# EAGLE design attinier85-motherboard-smd-mk-2.1 (EAGLE 7.5.0)
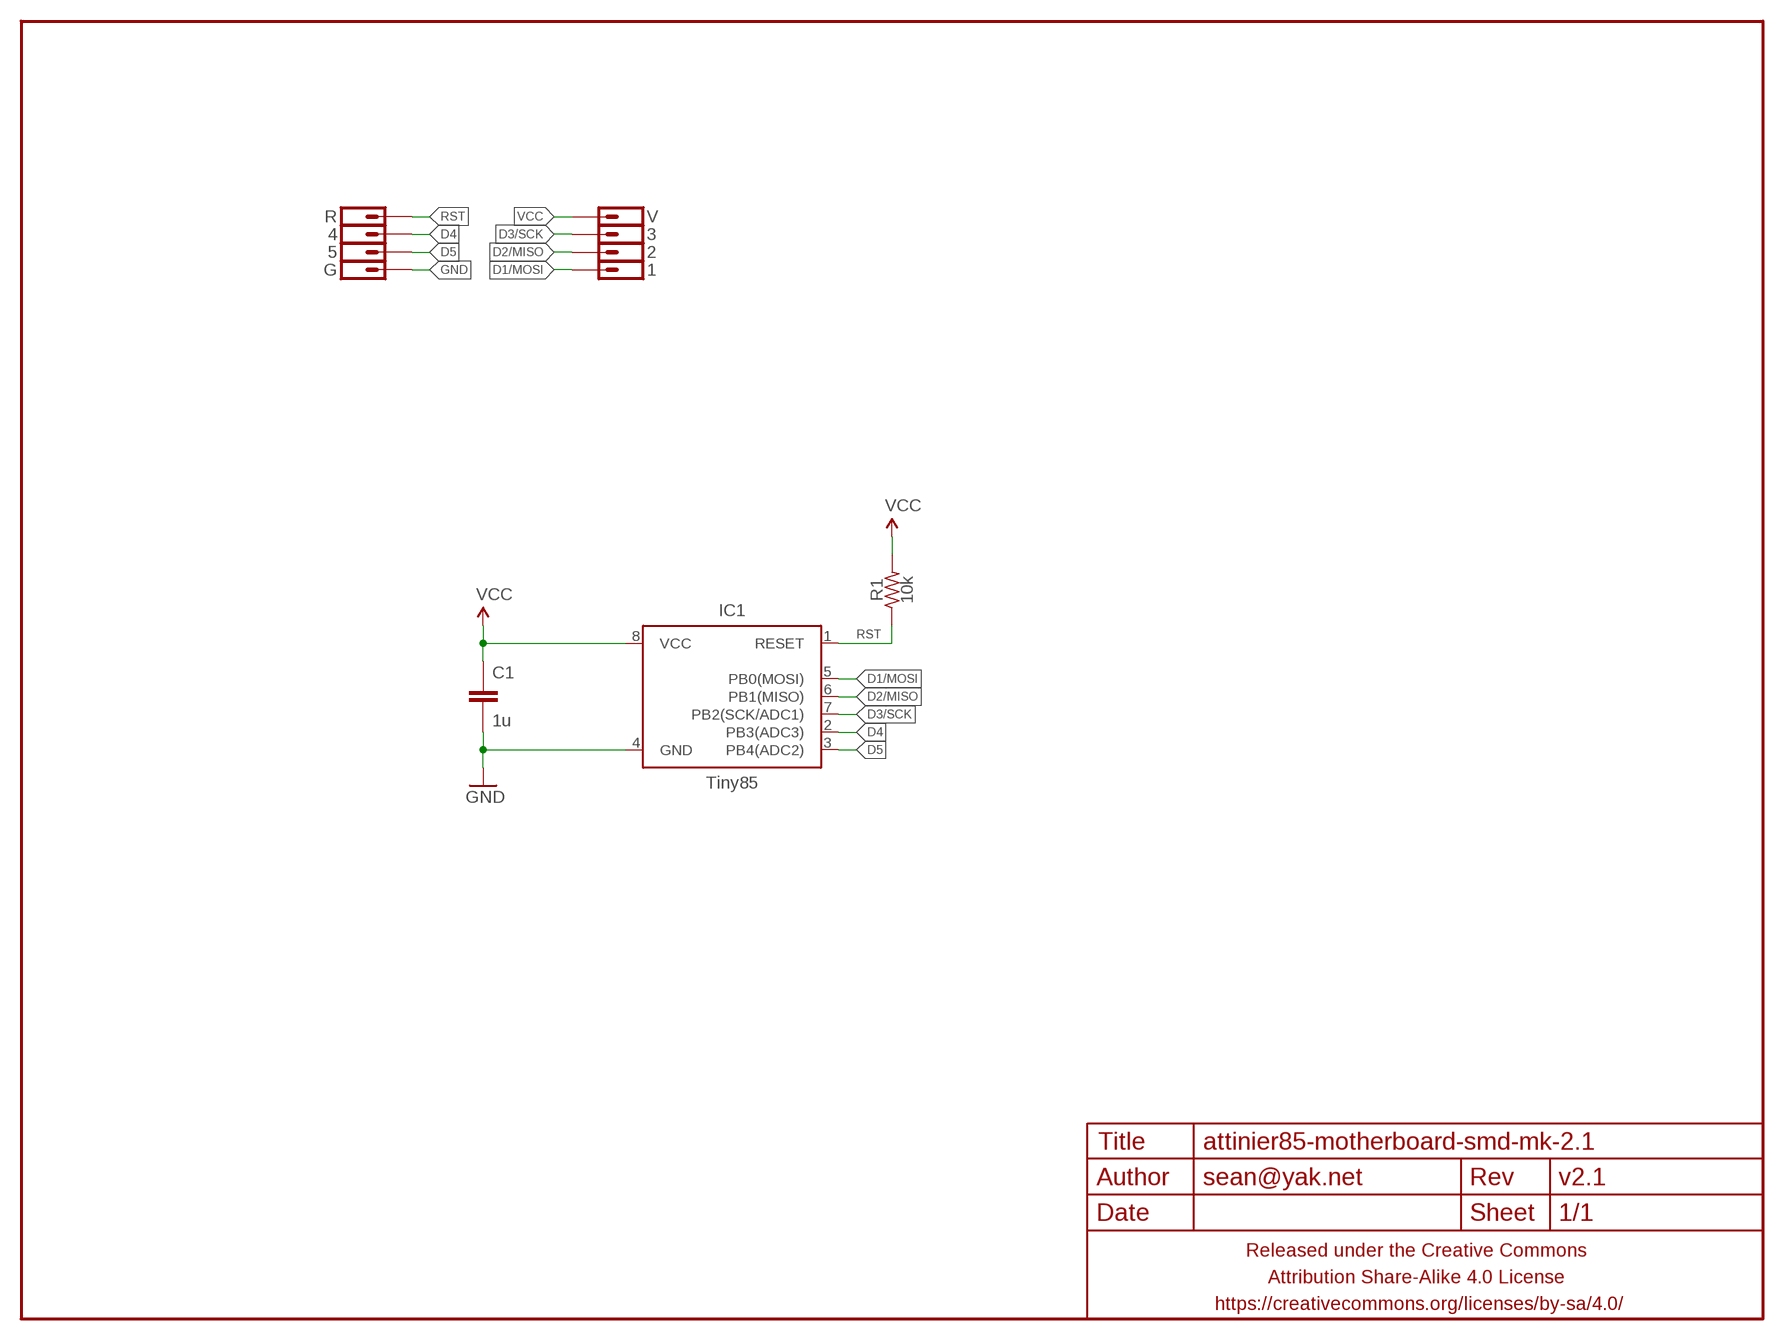
[diagram p0: schematic, sheet 1]

## Parts
1  M01PTH-0.9MM  [1X01-0.9MM]
2  M01PTH-0.9MM  [1X01-0.9MM]
3  M01PTH-0.9MM  [1X01-0.9MM]
4  M01PTH-0.9MM  [1X01-0.9MM]
5  M01PTH-0.9MM  [1X01-0.9MM]
C1  1u  CAPACITOR-CERAMICC0603-TIGHTER  [C0603-TIGHTER]
FRAME1  FRAME-LETTERNO_PACKAGE  [DUMMY]
G  M01PTH-0.9MM  [1X01-0.9MM]
IC1  Tiny85  ATTINY45TINY85-20-SOICW  [SO08-EIAJ]
R  M01PTH-0.9MM  [1X01-0.9MM]
R1  10k  RESISTORR0603-TIGHTER  [R0603-TIGHTER]
V  M01PTH-0.9MM  [1X01-0.9MM]

## Nets
D1/MOSI: 1.1 IC1.5(PB0(MOSI))
D2/MISO: 2.1 IC1.6(PB1(MISO))
D3/SCK: 3.1 IC1.7(PB2(SCK/ADC1))
D4: 4.1 IC1.2(PB3(ADC3))
D5: 5.1 IC1.3(PB4(ADC2))
GND: C1.2 G.1 IC1.4(GND)
RST: IC1.1(RESET) R1.1 R.1
VCC: C1.1 IC1.8(VCC) R1.2 V.1

## Library data of the parts
1-5 G R V = a_parts:M01: Header 1 Standard 1-pin 0.1" header. Use with straight break away headers (SKU : PRT-00116), right angle break away headers (PRT-00553), swiss pins (PRT-00743), machine pins (PRT-00117), and female headers (PRT-00115).
C1 = a_parts:CAPACITOR-CERAMIC: CAPACITOR, European symbol
FRAME1 = a_parts:FRAME-LETTER: Schematic Frame Standard 8.5x11 US Letter frame; DESIGNER: sean@yak.net; VERSION: v2.1
IC1 = a_parts:ATTINY45: Atmel 8-pin 2/4/8kB flash uC; PROD_ID: IC-09092; VALUE: Tiny85-20-SMT
R1 = a_parts:RESISTOR: RESISTOR, American symbol

## Board
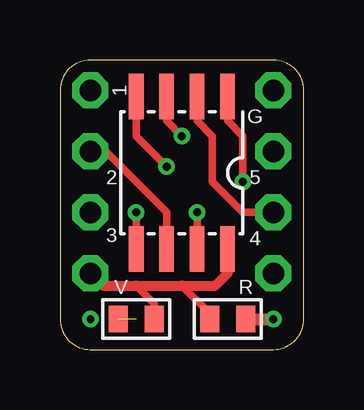
[diagram p1: board, top side]
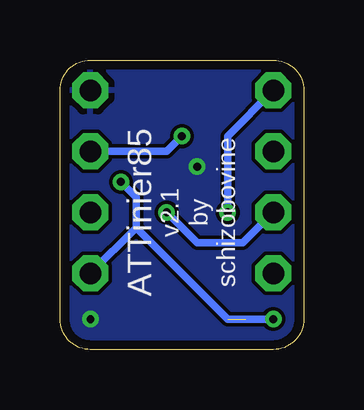
[diagram p2: board, bottom side, seen from below]

Size 10.16 x 12.06 mm. Coordinates in mm from the lower left corner, seen from the top.
Outline: 0,10.79 0,1.27 arc90 1.27,0 8.89,0 arc90 10.16,1.27 10.16,10.79 arc90 8.89,12.06 1.27,12.06 arc90 0,10.79
Copper layers (1*16): Top 0.0356mm / dielectric 1.5011mm / Bottom 0.0356mm
Design rules "LaenPCBOrder2": minimum track width 6mil, minimum drill 13mil, track to track 6mil, track to pad 6mil, pad to pad 6mil, via to via 6mil, smd to smd 6mil, copper to edge 15mil, drill to drill 6mil, minimum pad ring 7mil, minimum via ring 7mil, stop-mask expansion 3mil, vias tented up to drill 20mil, thermal gap 10mil

### Footprints (pad centres in the part's own frame; a part is rotated, then mirrored left to right if it is on the bottom)
1X01-0.9MM = drill 0.9 pad 1.5 octagon: 1 0,0
C0603-TIGHTER = smd 0.8 x 1.1: 1 -0.75,0; 2 0.75,0
SO08-EIAJ = smd 0.61 x 1.905: 1 -1.905,-3.175; 2 -0.635,-3.175; 3 0.635,-3.175; 4 1.905,-3.175; 5 1.905,3.175; 6 0.635,3.175; 7 -0.635,3.175; 8 -1.905,3.175
R0603-TIGHTER = smd 0.8 x 1.1: 1 -0.75,0; 2 0.75,0

### Placement (x,y rotation side)
1  1.27,10.79 270 top
2  1.27,8.26 270 top
3  1.27,5.71 270 top
4  8.89,5.71 90 top
5  8.89,8.26 90 top
C1  6.99,1.27 0 top
FRAME1  0,0 0 top
G  8.89,10.79 90 top
IC1  5.08,7.37 180 top
R  8.89,3.17 90 top
R1  3.17,1.27 0 top
V  1.27,3.17 270 top

### Tracks (layer width: path | path; a pad name or v marks a point on that pad's centre or on a via)
D1/MOSI  (via drill 0.33)
  Top 0.305: IC1.5 v3.17,5.71
  Bottom 0.305: v3.17,5.71 3.17,8.89 1.1
D2/MISO
  Top 0.305: IC1.6 4.45,5.71 1.91,8.26 2.1
D3/SCK  (via drill 0.33)
  Top 0.305: v5.71,5.71 IC1.7
  Bottom 0.305: 3.1 2.54,4.45 4.45,4.45 v5.71,5.71
D4
  Top 0.305: IC1.2 5.71,9.53 6.35,8.89 6.35,6.99 7.62,5.71 4.1
D5  (via drill 0.33)
  Top 0.305: IC1.3 4.45,9.53 v5.08,8.89
  Bottom 0.305: v5.08,8.89 5.71,8.26 5.1
GND  (via drill 0.33)
  Top 0.305: IC1.4 3.17,8.89 v4.45,7.62
  Top 0.508: C1.2 v8.89,1.27
  pour Bottom: 10.16,10.79 10.16,1.27 arc-90 8.89,0 1.27,0 arc-90 0,1.27 0,10.79 arc-90 1.27,12.06 8.89,12.06 arc-90
RST  (via drill 0.33)  (1 unrouted)
  Top 0.305: IC1.1 6.99,9.53 7.62,8.89 v7.62,6.99
  Bottom 0.305: v7.62,6.99 6.99,6.35 6.99,5.08 | 6.99,5.08 R.1 | v1.27,1.27 3.17,1.27 6.99,5.08
VCC
  Top 0.305: R1.2 3.92,1.92 3.17,2.67 | C1.1 6.24,1.51 5.08,2.67
  Top 0.406: IC1.8 6.99,3.17 6.48,2.67 5.08,2.67 3.17,2.67 1.78,2.67 V.1

### Text on the board
bPlace: by / schizobovine | ATTinier85